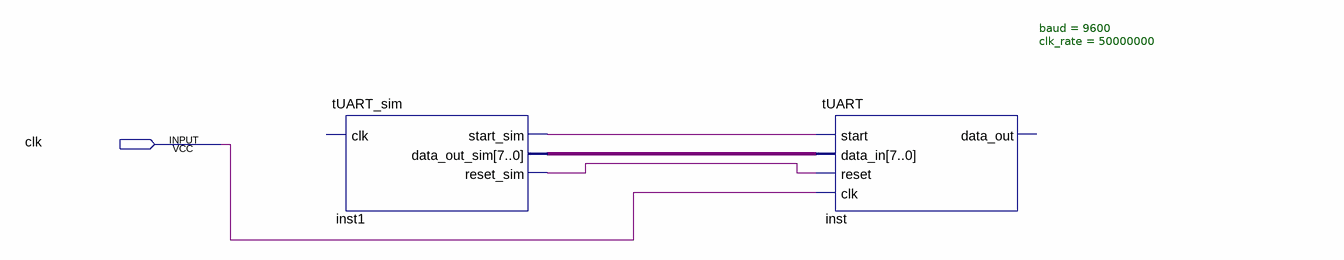
[diagram p0: schematic sheet]
// Quartus schematic Block1.bdf as structural Verilog: 2 symbols, 1 pins
module Block1 (
  input  clk
);

  wire inst1_reset_sim, inst1_start_sim;
  wire [7:0] inst1_data_out_sim;

  tUART_sim inst1 (
    .start_sim(inst1_start_sim), .data_out_sim(inst1_data_out_sim), .reset_sim(inst1_reset_sim));  // open: clk
  tUART #(.baud(9600), .clk_rate(50000000)) inst (
    .start(inst1_start_sim), .data_in(inst1_data_out_sim), .reset(inst1_reset_sim), .clk(clk));  // open: data_out
endmodule
